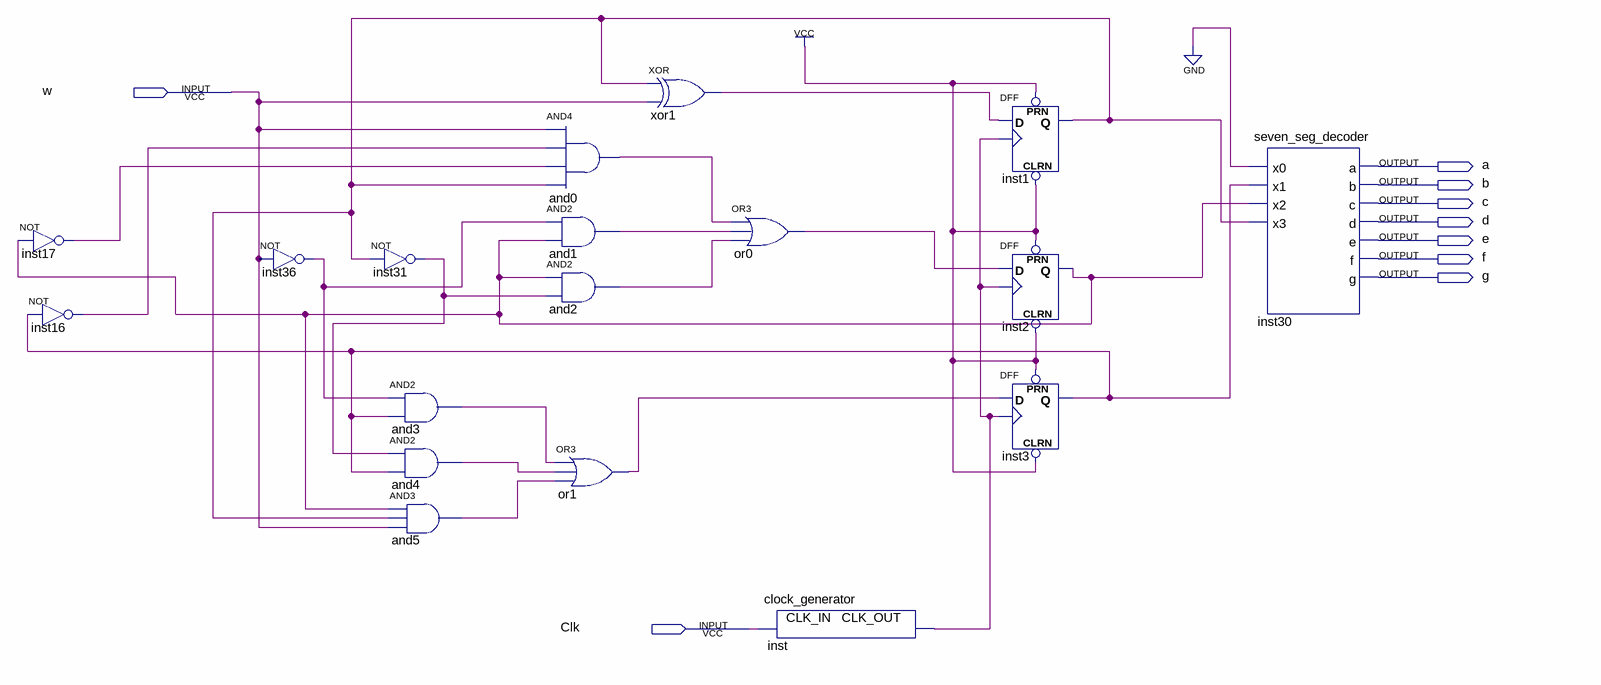
[diagram p0: schematic sheet]
// Quartus schematic Lab11step1.bdf as structural Verilog: 18 symbols, 9 pins
module Lab11step1 (
  input  w,
  input  Clk,
  output a,
  output b,
  output c,
  output d,
  output e,
  output f,
  output g
);

  wire and0_out, and1_out, and2_out, and3_out, and4_out, and5_out, inst1_q, inst2_q, inst3_q, inst16_out,
       inst17_out, inst31_out, inst36_out, inst_clk_out, or0_out, or1_out, xor1_out;

  not inst17 (inst17_out, inst2_q);
  not inst16 (inst16_out, inst3_q);
  not inst36 (inst36_out, w);
  not inst31 (inst31_out, inst1_q);
  and and3 (and3_out, inst36_out, inst3_q);
  and and4 (and4_out, inst31_out, inst3_q);
  and and5 (and5_out, inst2_q, inst1_q, w);
  and and0 (and0_out, w, inst16_out, inst17_out, inst1_q);
  and and1 (and1_out, inst36_out, inst2_q);
  and and2 (and2_out, inst2_q, inst31_out);
  or or1 (or1_out, and3_out, and4_out, and5_out);
  xor xor1 (xor1_out, inst1_q, w);
  or or0 (or0_out, and0_out, and1_out, and2_out);
  clock_generator inst (.CLK_IN(Clk), .CLK_OUT(inst_clk_out));
  DFF inst1 (.CLRN(1'b1), .CLK(inst_clk_out), .D(xor1_out), .PRN(1'b1), .Q(inst1_q));
  DFF inst2 (.CLRN(1'b1), .CLK(inst_clk_out), .D(or0_out), .PRN(1'b1), .Q(inst2_q));
  DFF inst3 (.CLRN(1'b1), .CLK(inst_clk_out), .D(or1_out), .PRN(1'b1), .Q(inst3_q));
  seven_seg_decoder inst30 (
    .x0(1'b0), .x1(inst3_q), .x2(inst2_q), .x3(inst1_q), .a(a), .b(b), .c(c), .d(d), .e(e), .f(f), .g(g));
endmodule
